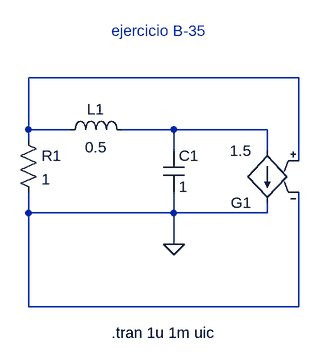
[diagram p0: schematic B-35.asc]
B-35.asc, the LTspice schematic file:
Version 4
SHEET 1 880 680
WIRE 704 176 288 176
WIRE 288 256 288 176
WIRE 352 256 288 256
WIRE 512 256 432 256
WIRE 656 256 512 256
WIRE 288 272 288 256
WIRE 512 288 512 256
WIRE 656 288 656 256
WIRE 704 304 704 176
WIRE 288 384 288 352
WIRE 512 384 512 352
WIRE 512 384 288 384
WIRE 656 384 656 368
WIRE 656 384 512 384
WIRE 512 432 512 384
WIRE 288 528 288 384
WIRE 704 528 704 352
WIRE 704 528 288 528
FLAG 512 432 0
SYMBOL Res 272 256 R0
SYMATTR InstName R1
SYMATTR Value 1
SYMBOL Ind 336 272 R270
WINDOW 0 32 56 VTop 2
WINDOW 3 5 56 VBottom 2
SYMATTR InstName L1
SYMATTR Value 0.5
SYMBOL g2 656 384 R180
SYMATTR InstName G1
SYMATTR Value 1.5
SYMBOL Cap 496 288 R0
SYMATTR InstName C1
SYMATTR Value 1
TEXT 416 104 Left 2 ;ejercicio B-35
TEXT 416 568 Left 2 !.tran 1u 1m uic

The netlist it stands for:
* B-35.asc
R1 N001 0 1
L1 N001 N002 0.5
G1 N002 0 N001 0 1.5
C1 N002 0 1
* ejercicio B-35
.tran 1u 1m uic
.backanno
.end